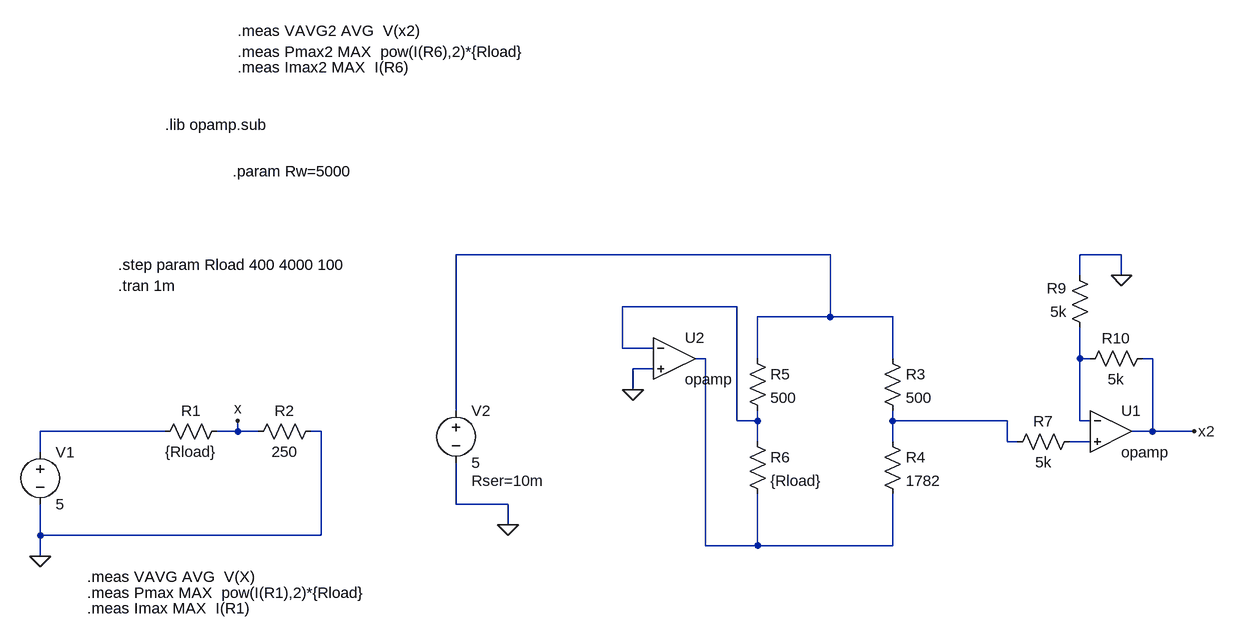
[diagram p0: schematic r_divider_vs_wheatstone_bridge.asc]
r_divider_vs_wheatstone_bridge.asc, the LTspice schematic file:
Version 4.1
SHEET 1 1940 680
WIRE 1296 -240 720 -240
WIRE 1744 -240 1680 -240
WIRE 1680 -208 1680 -240
WIRE 1744 -208 1744 -240
WIRE 1152 -160 976 -160
WIRE 1296 -144 1296 -240
WIRE 1296 -144 1184 -144
WIRE 1392 -144 1296 -144
WIRE 976 -96 976 -160
WIRE 1024 -96 976 -96
WIRE 1104 -80 1088 -80
WIRE 1184 -80 1184 -144
WIRE 1392 -80 1392 -144
WIRE 1680 -80 1680 -128
WIRE 1696 -80 1680 -80
WIRE 1792 -80 1776 -80
WIRE 1024 -64 992 -64
WIRE 992 -32 992 -64
WIRE 720 0 720 -240
WIRE 1152 16 1152 -160
WIRE 1184 16 1184 0
WIRE 1184 16 1152 16
WIRE 1392 16 1392 0
WIRE 1568 16 1392 16
WIRE 1680 16 1680 -80
WIRE 1696 16 1680 16
WIRE 272 32 80 32
WIRE 384 32 384 16
WIRE 384 32 352 32
WIRE 416 32 384 32
WIRE 512 32 496 32
WIRE 1792 32 1792 -80
WIRE 1792 32 1760 32
WIRE 1856 32 1792 32
WIRE 1184 48 1184 16
WIRE 1392 48 1392 16
WIRE 1568 48 1568 16
WIRE 1584 48 1568 48
WIRE 1696 48 1664 48
WIRE 80 64 80 32
WIRE 720 144 720 80
WIRE 800 144 720 144
WIRE 800 176 800 144
WIRE 80 192 80 144
WIRE 512 192 512 32
WIRE 512 192 80 192
WIRE 1104 208 1104 -80
WIRE 1184 208 1184 128
WIRE 1184 208 1104 208
WIRE 1392 208 1392 128
WIRE 1392 208 1184 208
WIRE 80 224 80 192
FLAG 80 224 0
FLAG 384 16 x
FLAG 1856 32 x2
FLAG 800 176 0
FLAG 992 -32 0
FLAG 1744 -208 0
SYMBOL voltage 80 48 R0
WINDOW 123 0 0 Left 0
WINDOW 39 0 0 Left 0
SYMATTR InstName V1
SYMATTR Value 5
SYMBOL res 368 16 R90
WINDOW 0 0 56 VBottom 2
WINDOW 3 32 56 VTop 2
SYMATTR InstName R1
SYMATTR Value {Rload}
SYMBOL res 512 16 R90
WINDOW 0 0 56 VBottom 2
WINDOW 3 32 56 VTop 2
SYMATTR InstName R2
SYMATTR Value 250
SYMBOL voltage 720 -16 R0
WINDOW 123 0 0 Left 0
WINDOW 39 24 124 Left 2
SYMATTR SpiceLine Rser=10m
SYMATTR InstName V2
SYMATTR Value 5
SYMBOL res 1376 -96 R0
SYMATTR InstName R3
SYMATTR Value 500
SYMBOL res 1376 32 R0
SYMATTR InstName R4
SYMATTR Value 1782
SYMBOL res 1168 -96 R0
SYMATTR InstName R5
SYMATTR Value 500
SYMBOL res 1168 32 R0
SYMATTR InstName R6
SYMATTR Value {Rload}
SYMBOL OpAmps\\opamp 1728 -32 R0
SYMATTR InstName U1
SYMBOL res 1680 32 R90
WINDOW 0 0 56 VBottom 2
WINDOW 3 32 56 VTop 2
SYMATTR InstName R7
SYMATTR Value 5k
SYMBOL res 1696 -112 R180
WINDOW 0 36 76 Left 2
WINDOW 3 36 40 Left 2
SYMATTR InstName R9
SYMATTR Value 5k
SYMBOL res 1792 -96 R90
WINDOW 0 0 56 VBottom 2
WINDOW 3 32 56 VTop 2
SYMATTR InstName R10
SYMATTR Value 5k
SYMBOL OpAmps\\opamp 1056 -144 R0
SYMATTR InstName U2
TEXT 200 -224 Left 2 !.step param Rload 400 4000 100
TEXT 200 -192 Left 2 !.tran 1m
TEXT 152 256 Left 2 !.meas VAVG AVG  V(X)
TEXT 152 280 Left 2 !.meas Pmax MAX  pow(I(R1),2)*{Rload}
TEXT 152 304 Left 2 !.meas Imax MAX  I(R1)
TEXT 272 -440 Left 2 !.lib opamp.sub
TEXT 384 -584 Left 2 !.meas VAVG2 AVG  V(x2)
TEXT 384 -552 Left 2 !.meas Pmax2 MAX  pow(I(R6),2)*{Rload}
TEXT 384 -528 Left 2 !.meas Imax2 MAX  I(R6)
TEXT 376 -368 Left 2 !.param Rw=5000

The netlist it stands for:
* r_divider_vs_wheatstone_bridge.asc
V1 N006 0 5
R1 x N006 {Rload}
R2 0 x 250
V2 N001 0 5 Rser=10m
R3 N001 N005 500
R4 N005 N003 1782
R5 N001 N002 500
R6 N002 N003 {Rload}
X§U1 N004 N007 x2 opamp Aol=100K GBW=10Meg  ; pins invin noninvin out
R7 N007 N005 5k
R9 N004 0 5k
R10 x2 N004 5k
X§U2 N002 0 N003 opamp Aol=100K GBW=10Meg  ; pins invin noninvin out
.step param Rload 400 4000 100
.tran 1m
.meas VAVG AVG  V(X)
.meas Pmax MAX  pow(I(R1),2)*{Rload}
.meas Imax MAX  I(R1)
.lib opamp.sub
.meas VAVG2 AVG  V(x2)
.meas Pmax2 MAX  pow(I(R6),2)*{Rload}
.meas Imax2 MAX  I(R6)
.param Rw=5000
.backanno
.end